# Altium schematic sheet CM5IO.SchDoc
size 1188 x 840 mm
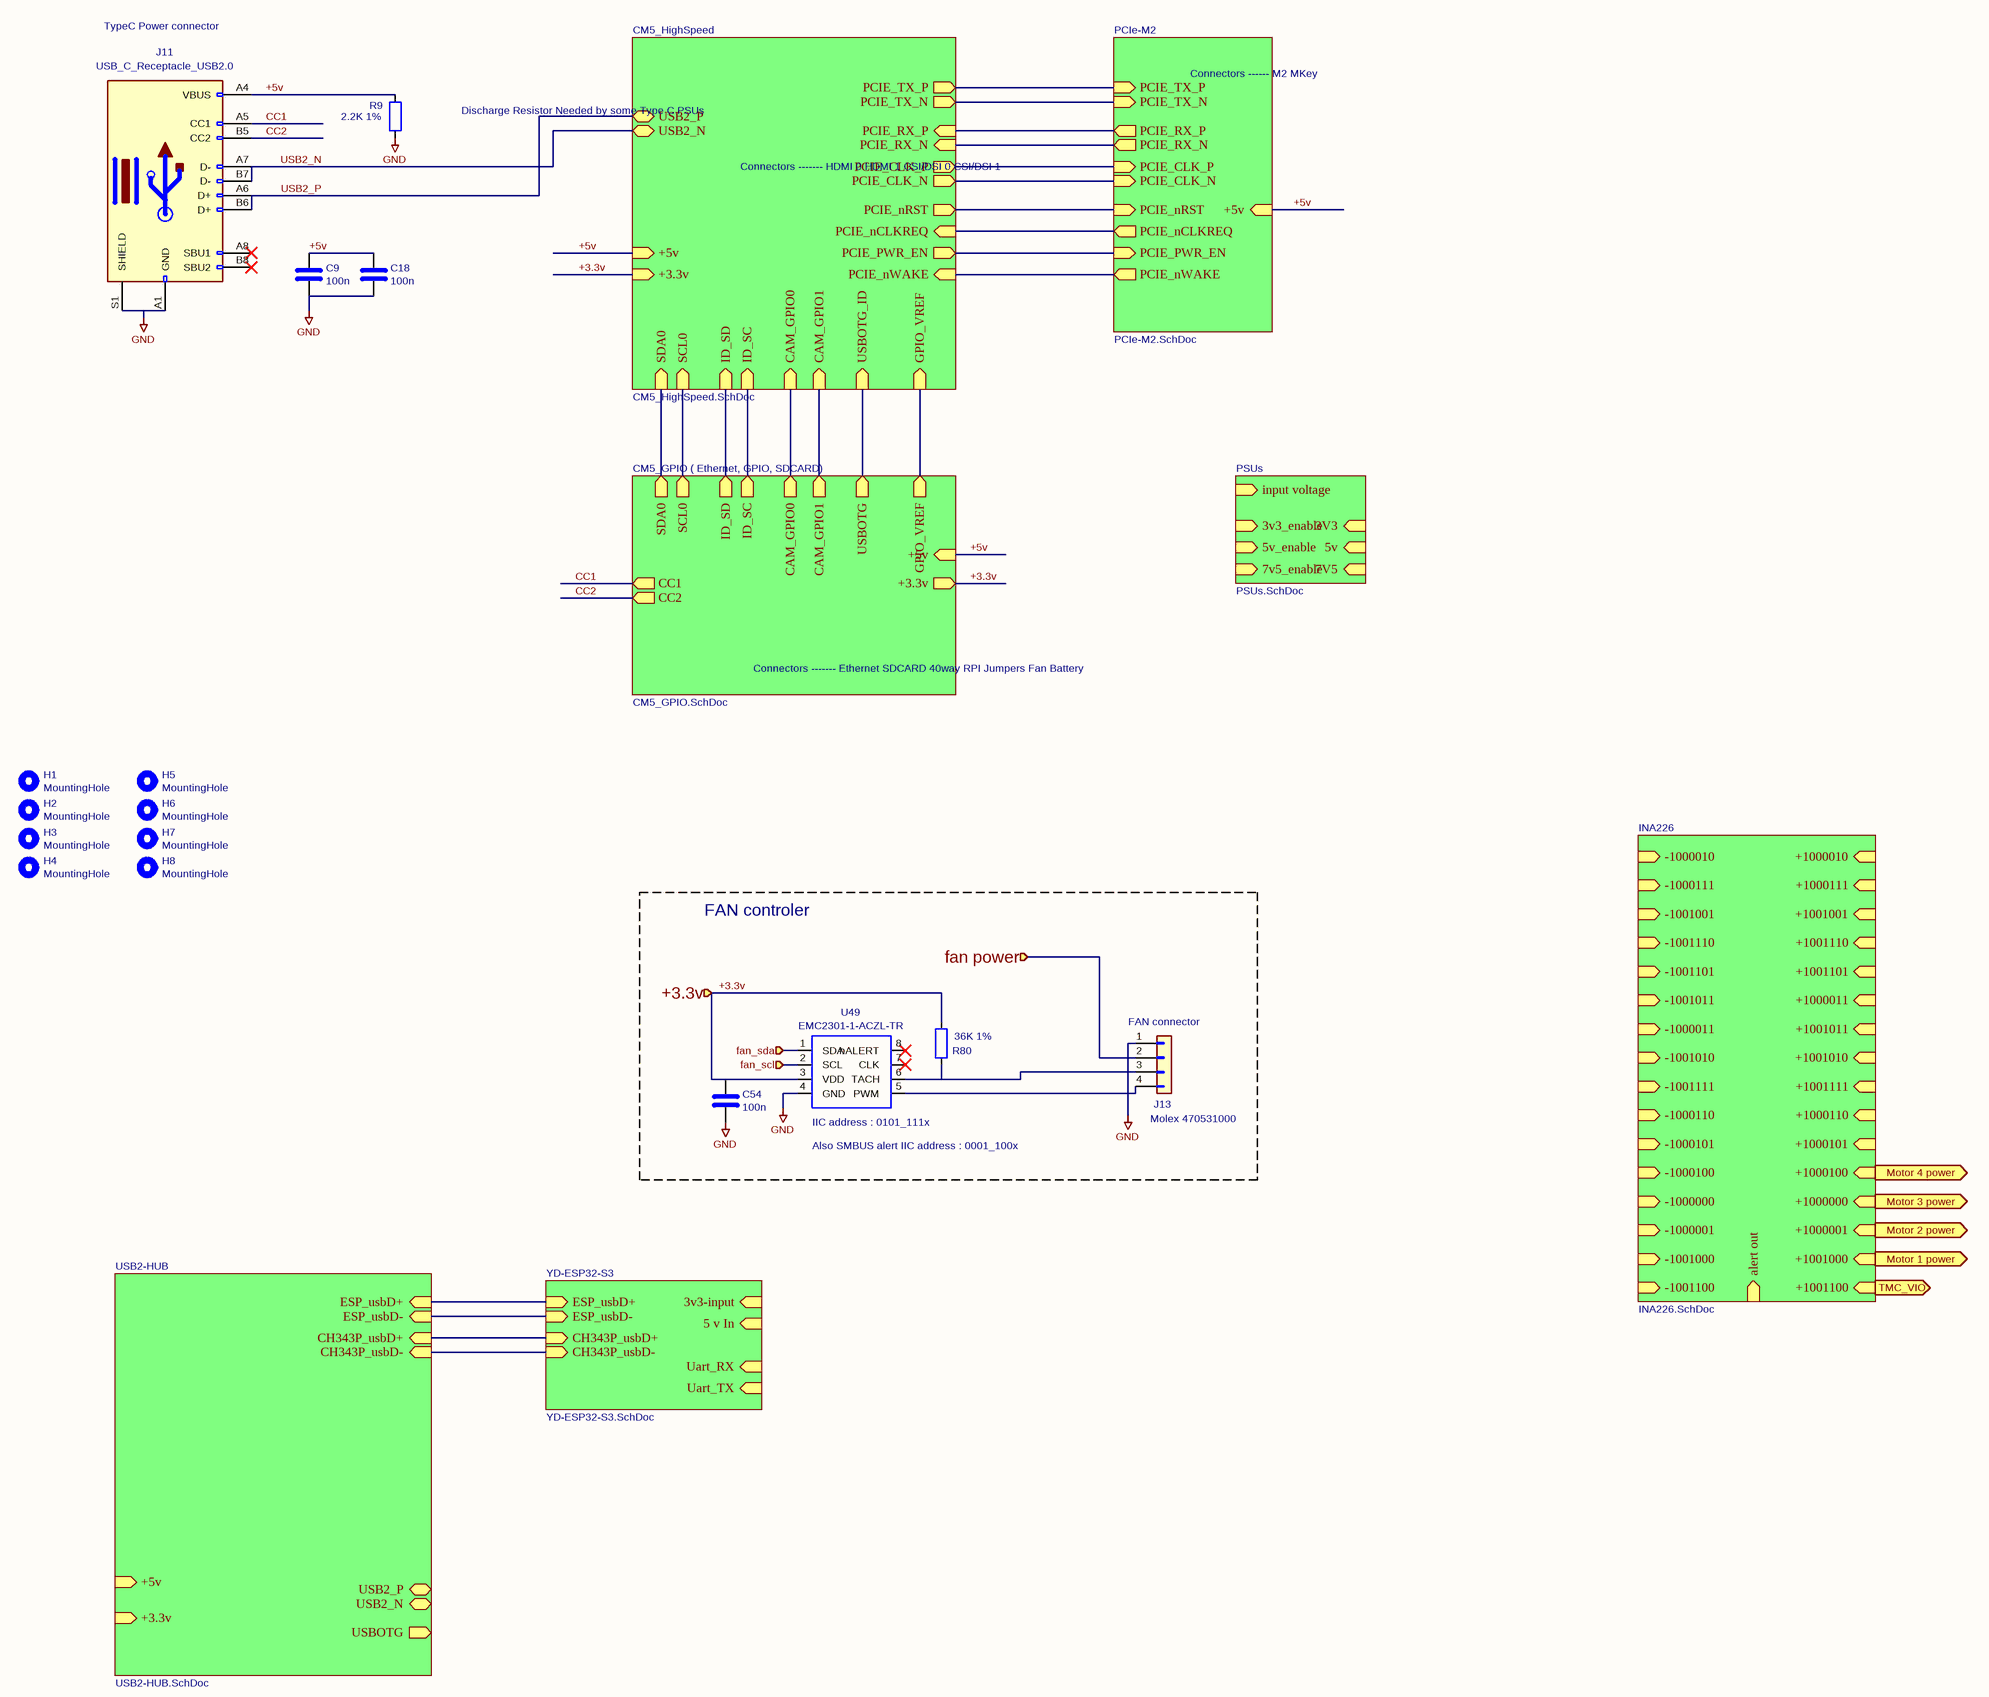
[diagram p0: CM5IO.SchDoc]

## Parts
C9  100n  [C_0402_1005Metric]
C18  100n  [C_0402_1005Metric]
C54  100n  [C_0805_2012Metric]
H1  MountingHole  [MountingHole_2.7mm_M2.5_DIN965]
H2  MountingHole  [MountingHole_2.7mm_M2.5_DIN965]
H3  MountingHole  [MountingHole_2.7mm_M2.5_DIN965]
H4  MountingHole  [MountingHole_2.7mm_M2.5_DIN965]
H5  MountingHole  [MountingHole_2.7mm_M2.5_DIN965]
H6  MountingHole  [MountingHole_2.7mm_M2.5_DIN965]
H7  MountingHole  [MountingHole_2.7mm_M2.5_DIN965]
H8  MountingHole  [MountingHole_2.7mm_M2.5_DIN965]
J11  USB_C_Receptacle_USB2.0  [USB_C_Receptacle_GCT_USB4105-xx-A_16P_TopMnt_Horizontal]
J13  Molex 470531000  [FanPinHeader_1x04_P2.54mm_Vertical]
R9  2.2K 1%  [R_0402_1005Metric]
R80  36K 1%  [R_0805_2012Metric_Pad1.20x1.40mm_HandSolder]
U49  EMC2301-1-ACZL-TR  [MSOP-8_3x3mm_P0.65mm]

## Blocks framed on the sheet
FAN controler: C54 J13 R80 U49

## Sub-sheets
CM5_GPIO ( Ethernet, GPIO, SDCARD) = CM5_GPIO.SchDoc: ID_SC (out), ID_SD (out), SCL0 (out), SDA0 (out), +5v (in), +3.3v (out), GPIO_VREF (out), CAM_GPIO0 (out), CAM_GPIO1 (out), CC1 (out), USBOTG (out), CC2 (out)
CM5_HighSpeed = CM5_HighSpeed.SchDoc: USB2_N (bidir), USB2_P (bidir), ID_SC (in), ID_SD (in), SCL0 (in), SDA0 (in), +5v (in), PCIE_CLK_P (out), PCIE_CLK_N (out), PCIE_TX_P (out), PCIE_TX_N (out), PCIE_nRST (out), PCIE_RX_P (in), PCIE_RX_N (in), PCIE_nCLKREQ (in), +3.3v (in), USBOTG_ID (in), GPIO_VREF (in), PCIE_PWR_EN (out), PCIE_nWAKE (in), CAM_GPIO0 (in), CAM_GPIO1 (in)
INA226 = INA226.SchDoc: -1000000 (in), +1000000 (in), alert out (in), -1000001 (in), +1000001 (in), -1001000 (in), +1001000 (in), -1001100 (in), +1001100 (in), -1000100 (in), +1000100 (in), -1000101 (in), +1000101 (in), -1001010 (in), +1001010 (in), -1001110 (in), -1001101 (in), +1001110 (in), -1001001 (in), +1001001 (in), -1000111 (in), +1000111 (in), -1001011 (in), +1001011 (in), -1001111 (in), +1001111 (in), +1001101 (in), -1000011 (in), +1000011 (in), -1000110 (in), +1000110 (in), -1000010 (in), +1000010 (in)
PCIe-M2 = PCIe-M2.SchDoc: PCIE_CLK_P (in), PCIE_CLK_N (in), PCIE_TX_P (in), PCIE_TX_N (in), PCIE_nCLKREQ (out), PCIE_nRST (in), PCIE_RX_P (out), PCIE_RX_N (out), +5v (in), PCIE_PWR_EN (in), PCIE_nWAKE (out)
PSUs = PSUs.SchDoc: 3v3_enable (in), input voltage (in), 5v (in), 5v_enable (in), 3V3 (in), 7v5_enable (in), 7V5 (in)
USB2-HUB = USB2-HUB.SchDoc: USB2_N (bidir), USB2_P (bidir), +5v (in), +3.3v (in), USBOTG (out), ESP_usbD+ (in), ESP_usbD- (in), CH343P_usbD+ (in), CH343P_usbD- (in)
YD-ESP32-S3 = YD-ESP32-S3.SchDoc: 3v3-input (in), ESP_usbD+ (in), ESP_usbD- (in), 5 v In (in), CH343P_usbD+ (in), CH343P_usbD- (in), Uart_RX (in), Uart_TX (in)

## Ports
+3.3v (in), fan power (in), fan_scl (in), fan_sda (in), Motor 1 power (in), Motor 2 power (in), Motor 3 power (in), Motor 4 power (in), TMC_VIO (in)

## Nets
GND: C9.2 C18.2 C54.2 J11.A1(GND) J11.S1(SHIELD) J13.1(Pin_1) R9.2 U49.4(GND)
+3.3v: C54.1 R80.2 U49.3(VDD) ; port +3.3v, sheet CM5_GPIO ( Ethernet, GPIO, SDCARD)/+3.3v, sheet CM5_HighSpeed/+3.3v
+5v: C9.1 C18.1 J11.A4(VBUS) R9.1 ; sheet CM5_GPIO ( Ethernet, GPIO, SDCARD)/+5v, sheet CM5_HighSpeed/+5v, sheet PCIe-M2/+5v
CC1: J11.A5(CC1) ; sheet CM5_GPIO ( Ethernet, GPIO, SDCARD)/CC1
CC2: J11.B5(CC2) ; sheet CM5_GPIO ( Ethernet, GPIO, SDCARD)/CC2
fan power: J13.2(Pin_2) ; port fan power
fan_scl: U49.2(SCL) ; port fan_scl
fan_sda: U49.1(SDA) ; port fan_sda
Motor 1 power: port Motor 1 power, sheet INA226/+1001000
Motor 2 power: port Motor 2 power, sheet INA226/+1000001
Motor 3 power: port Motor 3 power, sheet INA226/+1000000
Motor 4 power: port Motor 4 power, sheet INA226/+1000100
TMC_VIO: port TMC_VIO, sheet INA226/+1001100
USB2_N: J11.A7(D-) J11.B7(D-) ; sheet CM5_HighSpeed/USB2_N
USB2_P: J11.A6(D+) J11.B6(D+) ; sheet CM5_HighSpeed/USB2_P
NetJ13_3: J13.3(Pin_3) R80.1 U49.6(TACH)
NetJ13_4: J13.4(Pin_4) U49.5(PWM)
(unnamed): sheet CM5_GPIO ( Ethernet, GPIO, SDCARD)/ID_SC, sheet CM5_HighSpeed/ID_SC
(unnamed): sheet CM5_GPIO ( Ethernet, GPIO, SDCARD)/ID_SD, sheet CM5_HighSpeed/ID_SD
(unnamed): sheet CM5_GPIO ( Ethernet, GPIO, SDCARD)/SCL0, sheet CM5_HighSpeed/SCL0
(unnamed): sheet CM5_GPIO ( Ethernet, GPIO, SDCARD)/SDA0, sheet CM5_HighSpeed/SDA0
(unnamed): sheet CM5_GPIO ( Ethernet, GPIO, SDCARD)/GPIO_VREF, sheet CM5_HighSpeed/GPIO_VREF
(unnamed): sheet CM5_GPIO ( Ethernet, GPIO, SDCARD)/CAM_GPIO0, sheet CM5_HighSpeed/CAM_GPIO0
(unnamed): sheet CM5_GPIO ( Ethernet, GPIO, SDCARD)/CAM_GPIO1, sheet CM5_HighSpeed/CAM_GPIO1
(unnamed): sheet CM5_GPIO ( Ethernet, GPIO, SDCARD)/USBOTG, sheet CM5_HighSpeed/USBOTG_ID
(unnamed): sheet CM5_HighSpeed/PCIE_CLK_P, sheet PCIe-M2/PCIE_CLK_P
(unnamed): sheet CM5_HighSpeed/PCIE_CLK_N, sheet PCIe-M2/PCIE_CLK_N
(unnamed): sheet CM5_HighSpeed/PCIE_TX_P, sheet PCIe-M2/PCIE_TX_P
(unnamed): sheet CM5_HighSpeed/PCIE_TX_N, sheet PCIe-M2/PCIE_TX_N
(unnamed): sheet CM5_HighSpeed/PCIE_nRST, sheet PCIe-M2/PCIE_nRST
(unnamed): sheet CM5_HighSpeed/PCIE_RX_P, sheet PCIe-M2/PCIE_RX_P
(unnamed): sheet CM5_HighSpeed/PCIE_RX_N, sheet PCIe-M2/PCIE_RX_N
(unnamed): sheet CM5_HighSpeed/PCIE_nCLKREQ, sheet PCIe-M2/PCIE_nCLKREQ
(unnamed): sheet CM5_HighSpeed/PCIE_PWR_EN, sheet PCIe-M2/PCIE_PWR_EN
(unnamed): sheet CM5_HighSpeed/PCIE_nWAKE, sheet PCIe-M2/PCIE_nWAKE
(unnamed): sheet YD-ESP32-S3/ESP_usbD+, sheet USB2-HUB/ESP_usbD+
(unnamed): sheet YD-ESP32-S3/ESP_usbD-, sheet USB2-HUB/ESP_usbD-
(unnamed): sheet YD-ESP32-S3/CH343P_usbD+, sheet USB2-HUB/CH343P_usbD+
(unnamed): sheet YD-ESP32-S3/CH343P_usbD-, sheet USB2-HUB/CH343P_usbD-

Not connected (* = marked no-connect by the designer): J11 A8(SBU1)* A9(VBUS) A12(GND) B1(GND) B4(VBUS) B8(SBU2)* B9(VBUS) B12(GND); U49 7(CLK)* 8(nALERT)*

## Notes on the sheet
- TypeC Power connector
- Connectors
  ------
  M2 MKey
- Discharge Resistor
  Needed by some
  Type C PSUs
- Connectors
  -------
  HDMI 0
  HDMI 1
  CSI/DSI 0
  CSI/DSI 1
- Connectors
  -------
  Ethernet
  SDCARD
  40way RPI
  Jumpers
  Fan
  Battery
- (near J13) FAN connector
- (near U49) IIC address : 0101_111x
- (near U49) Also SMBUS alert IIC address : 0001_100x
- 1
- 2
- 3
- 4
- 5
- 6
- 7
- 8
- 9
- 10
- 11
- 12
- 13
- 14
- 15
- 16
- 17
- 18
- 19
- 20
- 21
- 22
- 23
- A
- B
- C
- D
- E
- F
- G
- H
- I
- J
- K
- L
- M
- N
- O
- P
- www.raspberrypi.com <http://www.raspberrypi.com>
- Title: Compute Module 5 IO Board - Top Level
- File: CM5IO.kicad_sch
- Sheet: /
- Copyright © 2024 Raspberry Pi Ltd.
- KiCad E.D.A.  kicad (5.1.4)-1
- Size: A0
- Date:
- Rev: 1
- Id: 1/1

## Library data of the parts
C9 C18 = C: Part Description: 0.1uF 10% 16V Ceramic Capacitor X7R 0402 (1005 Metric); Field4: Farnell; Field5: 2611911; Field6: RM EMK105 B7104KV-F; Field7: TAIYO YUDEN EUROPE GMBH; Field8: 110091611; Value: 100n; Footprint: Capacitor_SMD:C_0402_1005Metric
C54 = C: Part Description: 0.1uF 10% 16V Ceramic Capacitor X7R 0402 (1005 Metric); Description: Unpolarized capacitor; Field4: Farnell; Field5: 2611911; Field6: RM EMK105 B7104KV-F; Field7: TAIYO YUDEN EUROPE GMBH; Field8: 110091611; Value: 100n; Footprint: Capacitor_SMD:C_0805_2012Metric
H1-H8 = MountingHole: Part Description: M2.5 mounting hole; Field4: nf; Field5: nf; Field6: nf; Field7: nf; Value: MountingHole; Footprint: CM5IO:MountingHole_2.7mm_M2.5_DIN965
J11 = USB_C_Receptacle_USB2.0_16P: Part Description: USBC USB2 data and power connector; Field5: USBF31-0171; Field7: MTCONN; Field6: USBF31-0171; Value: USB_C_Receptacle_USB2.0; Footprint: Connector_USB:USB_C_Receptacle_GCT_USB4105-xx-A_16P_TopMnt_Horizontal
J13 = Conn_01x04: Part Description: Connector Header Through Hole 4 position 0.100" (2.54mm); Description: Generic connector, single row, 01x04, script generated (kicad-library-utils/schlib/autogen/connector/); Field4: Farnell; Field5: 2313705; Field6: 470531000; Field7: Molex; Value: Molex 470531000; Footprint: Connector:FanPinHeader_1x04_P2.54mm_Vertical
R9 = R: Part Description: Resistor 2.2K M1005 1% 63mW; Field4: Farnell; Value: 2.2K 1%; Footprint: Resistor_SMD:R_0402_1005Metric
R80 = R: Part Description: Resistor 36K M1005 1% 63mW; Description: Resistor; Field4: Farnell; Field5: 1458788; Field7: Rohm; Field6: MCR01MZPF3602; Value: 36K 1%; Footprint: Resistor_SMD:R_0805_2012Metric_Pad1.20x1.40mm_HandSolder
U49 = EMC2301: Part Description: Motor Driver PWM 8-MSOP; Field4: Digikey; Field5: EMC2301-1-ACZL-CT-ND; Field7: Microchip; Field6: EMC2301-1-ACZL-TR; Value: EMC2301-1-ACZL-TR; Footprint: Package_SO:MSOP-8_3x3mm_P0.65mm